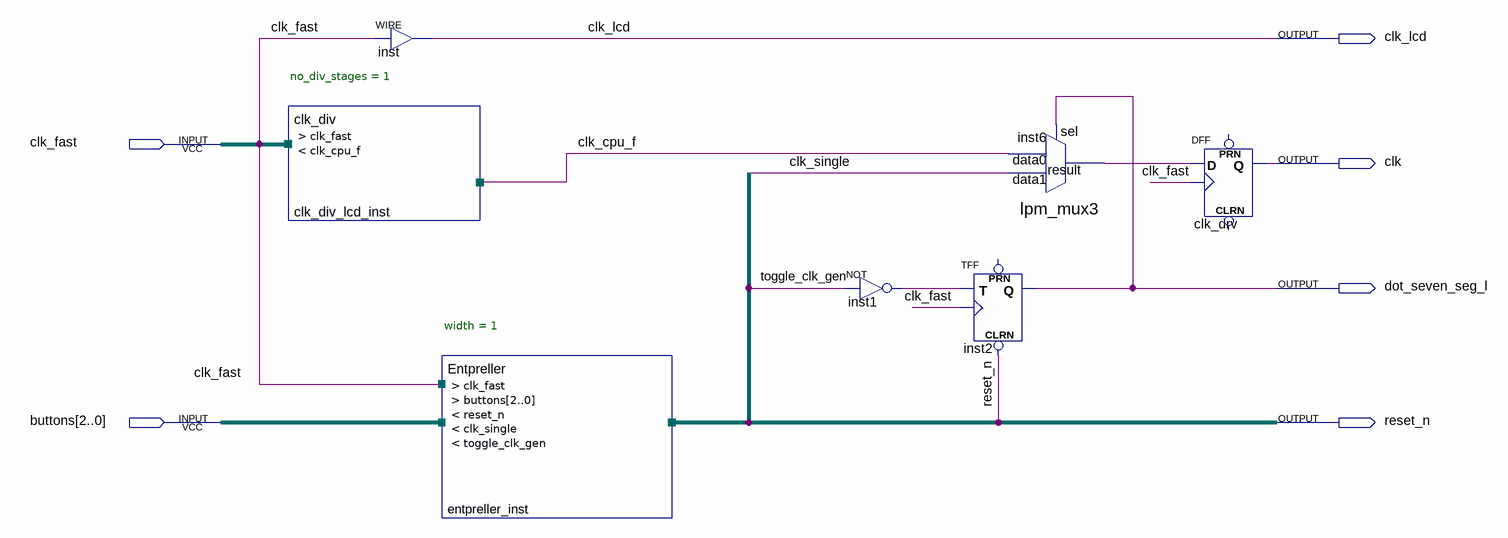
[diagram p0: schematic sheet]
// Quartus schematic environment.bdf as structural Verilog: 7 symbols, 6 pins
module environment (
  input  clk_fast,
  input  [2:0] buttons,
  output clk_lcd,
  output clk,
  output dot_seven_seg_l,
  output reset_n
);

  wire clk_cpu_f, clk_single, inst1_out, inst6_result, toggle_clk_gen;

  clk_div #(.no_div_stages(1)) clk_div_lcd_inst (.clk_fast(clk_fast), .clk_cpu_f(clk_cpu_f));
  assign clk_lcd = clk_fast;  // WIRE inst
  Entpreller #(.width(1)) entpreller_inst (
    .clk_fast(clk_fast), .buttons(buttons), .reset_n(reset_n), .clk_single(clk_single),
    .toggle_clk_gen(toggle_clk_gen));
  not inst1 (inst1_out, toggle_clk_gen);
  lpm_mux3 inst6 (.data1(clk_single), .data0(clk_cpu_f), .sel(dot_seven_seg_l), .result(inst6_result));
  TFF inst2 (.CLRN(reset_n), .T(inst1_out), .CLK(clk_fast), .Q(dot_seven_seg_l));  // open: PRN
  DFF clk_drv (.CLK(clk_fast), .D(inst6_result), .Q(clk));  // open: CLRN, PRN
endmodule
